# Altium schematic sheet SmartIMU_Dev_Sch.SchDoc: SmartIMU Dev
size 304 x 203 mm; Author: Hom; CompanyName: KitSprout; DrawnBy: Hom; Engineer: Hom; Organization: KitSprout; Revision: A; SheetNumber: 1; SheetTotal: 1; Version: 1.0; LibVersion: 2.10; PageSetup: Record=PageOptions|CenterHorizontal=True|CenterVertical=True|PrintScale=0.96|XCorrection=1.00|YCorrection=1.00|PrintKind=0|BorderSize=5000000|LeftOffset=0|BottomOffset=0|Orientation=2|PaperLength=1000|PaperWidth=1000|Scale=100|PaperSource=7|PrintQuality=-3|MediaType=1|DitherType=10|PrintScaleMode=1|PaperKind=A4|PaperIndex=9
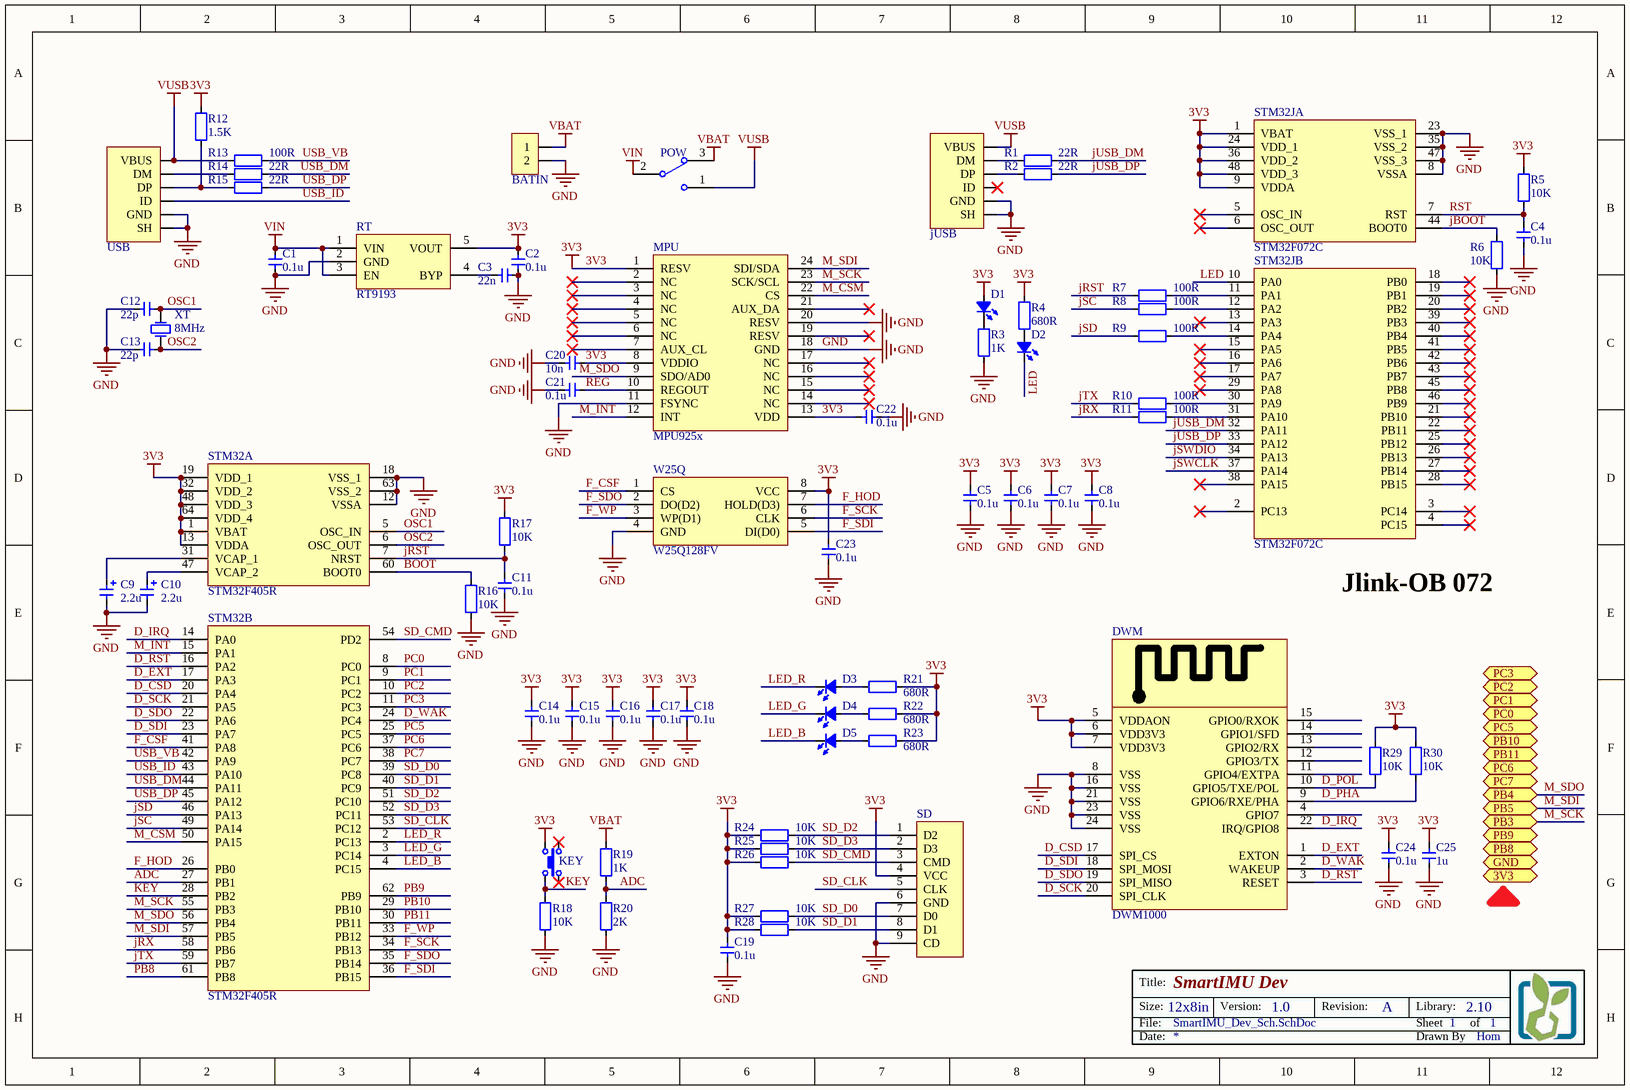
[diagram p0: SmartIMU_Dev_Sch.SchDoc]

## Parts
BATIN  MX1.25_2P  [MX1.25_S90_2P]  (value not drawn)
C1  value 0.1u  [CAP_0603]  (hidden comment: Cap_0603)
C2  value 0.1u  [CAP_0603]  (hidden comment: Cap_0603)
C3  value 22n  [CAP_0603]  (hidden comment: Cap_0603)
C4  value 0.1u  [CAP_0603]  (hidden comment: Cap_0603)
C5  value 0.1u  [CAP_0603]  (hidden comment: Cap_0603)
C6  value 0.1u  [CAP_0603]  (hidden comment: Cap_0603)
C7  value 0.1u  [CAP_0603]  (hidden comment: Cap_0603)
C8  value 0.1u  [CAP_0603]  (hidden comment: Cap_0603)
C9  value 2.2u  [CAP_TAN_P0805]  (hidden comment: Cap_Tan_0805)
C10  value 2.2u  [CAP_TAN_P0805]  (hidden comment: Cap_Tan_0805)
C11  value 0.1u  [CAP_0603]  (hidden comment: Cap_0603)
C12  value 22p  [CAP_0603]  (hidden comment: Cap_0603)
C13  value 22p  [CAP_0603]  (hidden comment: Cap_0603)
C14  value 0.1u  [CAP_0603]  (hidden comment: Cap_0603)
C15  value 0.1u  [CAP_0603]  (hidden comment: Cap_0603)
C16  value 0.1u  [CAP_0603]  (hidden comment: Cap_0603)
C17  value 0.1u  [CAP_0603]  (hidden comment: Cap_0603)
C18  value 0.1u  [CAP_0603]  (hidden comment: Cap_0603)
C19  value 0.1u  [CAP_0603]  (hidden comment: Cap_0603)
C20  value 10n  [CAP_0603]  (hidden comment: Cap_0603)
C21  value 0.1u  [CAP_0603]  (hidden comment: Cap_0603)
C22  value 0.1u  [CAP_0603]  (hidden comment: Cap_0603)
C23  value 0.1u  [CAP_0603]  (hidden comment: Cap_0603)
C24  value 0.1u  [CAP_0603]  (hidden comment: Cap_0603)
C25  value 1u  [CAP_0603]  (hidden comment: Cap_0603)
D1  LED_0603  [LED_0603_YELLOW]  (value not drawn)
D2  LED_0603  [LED_0603_ORANGE]  (value not drawn)
D3  LED_0603  [LED_0603_RED]  (value not drawn)
D4  LED_0603  [LED_0603_GREEN]  (value not drawn)
D5  LED_0603  [LED_0603_BLUE]  (value not drawn)
DWM  DWM1000  [DWM1000]
jUSB  USB_Micro  [USB_Micro-AB]  (value not drawn)
KEY  ButtonTACT  [ButtonTACT_3.5*3.55_90]  (value not drawn)
MPU  MPU925x  [QFN_P0.4_24]
POW  SwitchSPDT_2.8x6.6_90  [SwitchSPDT_2.8X6.6_90]  (value not drawn)
R1  value 22R  [RES_0603]  (hidden comment: Res_0603)
R2  value 22R  [RES_0603]  (hidden comment: Res_0603)
R3  value 1K  [RES_0603]  (hidden comment: Res_0603)
R4  value 680R  [RES_0603]  (hidden comment: Res_0603)
R5  value 10K  [RES_0603]  (hidden comment: Res_0603)
R6  value 10K  [RES_0603]  (hidden comment: Res_0603)
R7  value 100R  [RES_0603]  (hidden comment: Res_0603)
R8  value 100R  [RES_0603]  (hidden comment: Res_0603)
R9  value 100R  [RES_0603]  (hidden comment: Res_0603)
R10  value 100R  [RES_0603]  (hidden comment: Res_0603)
R11  value 100R  [RES_0603]  (hidden comment: Res_0603)
R12  value 1.5K  [RES_0603]  (hidden comment: Res_0603)
R13  value 100R  [RES_0603]  (hidden comment: Res_0603)
R14  value 22R  [RES_0603]  (hidden comment: Res_0603)
R15  value 22R  [RES_0603]  (hidden comment: Res_0603)
R16  value 10K  [RES_0603]  (hidden comment: Res_0603)
R17  value 10K  [RES_0603]  (hidden comment: Res_0603)
R18  value 10K  [RES_0603]  (hidden comment: Res_0603)
R19  value 1K  [RES_0603]  (hidden comment: Res_0603)
R20  value 2K  [RES_0603]  (hidden comment: Res_0603)
R21  value 680R  [RES_0603]  (hidden comment: Res_0603)
R22  value 680R  [RES_0603]  (hidden comment: Res_0603)
R23  value 680R  [RES_0603]  (hidden comment: Res_0603)
R24  value 10K  [RES_0603]  (hidden comment: Res_0603)
R25  value 10K  [RES_0603]  (hidden comment: Res_0603)
R26  value 10K  [RES_0603]  (hidden comment: Res_0603)
R27  value 10K  [RES_0603]  (hidden comment: Res_0603)
R28  value 10K  [RES_0603]  (hidden comment: Res_0603)
R29  value 10K  [RES_0603]  (hidden comment: Res_0603)
R30  value 10K  [RES_0603]  (hidden comment: Res_0603)
RT  RT9193  [SOT23-5]
SD  SD_Card_TF  [SD_Card_TF]  (value not drawn)
STM32  STM32F405R  [LQFP_P0.5_64]  (parts A,B of 2)
STM32J  STM32F072C  [LQFP_P0.5_48]  (parts A,B of 2)
USB  USB_Micro  [USB_Micro-AB]  (value not drawn)
W25Q  W25Q128FV  [SON_P1.27H_8]
XT  value 8MHz  [XT_5032_2]  (hidden comment: XTAL_5032_2P)

## Ports
3V3, GND, PB3, PB4, PB5, PB8, PB9, PB10, PB11, PC0, PC1, PC2, PC3, PC5, PC6, PC7

## Nets
3V3: C2.2 C5.2 C6.2 C7.2 C8.2 C14.1 C15.1 C16.1 C17.1 C18.2 C19.1 C20.2 C22.2 C23.1 C24.1 C25.1 D1.1(A) DWM.5(VDDAON) DWM.6(VDD3V3) DWM.7(VDD3V3) KEY.2 MPU.1(RESV) MPU.8(VDDIO) MPU.13(VDD) R4.2 R5.2 R12.1 R17.2 R21.1 R22.1 R23.1 R24.2 R25.2 R26.2 R27.2 R28.2 R29.2 R30.2 RT.5(VOUT) SD.4(VCC) STM32.1(VBAT) STM32.13(VDDA) STM32.19(VDD_1) STM32.32(VDD_2) STM32.48(VDD_3) STM32.64(VDD_4) STM32J.1(VBAT) STM32J.9(VDDA) STM32J.24(VDD_1) STM32J.36(VDD_2) STM32J.48(VDD_3) W25Q.8(VCC)
GND: BATIN.2 C1.1 C2.1 C3.1 C4.1 C5.1 C6.1 C7.1 C8.1 C9.2 C10.2 C11.1 C12.2 C13.2 C14.2 C15.2 C16.2 C17.2 C18.1 C19.2 C20.1 C21.1 C22.1 C23.2 C24.2 C25.2 DWM.8(VSS) DWM.16(VSS) DWM.21(VSS) DWM.23(VSS) DWM.24(VSS) jUSB.0(SH) jUSB.5(GND) MPU.11(FSYNC) MPU.18(GND) MPU.20(RESV) R3.1 R6.1 R16.1 R18.1 R20.2 RT.2(GND) SD.6(GND) SD.9(CD) STM32.12(VSSA) STM32.18(VSS_1) STM32.63(VSS_2) STM32J.8(VSSA) STM32J.23(VSS_1) STM32J.35(VSS_2) STM32J.47(VSS_3) USB.0(SH) USB.5(GND) W25Q.4(GND)
VBAT: BATIN.1 POW.3 R19.1
VIN: C1.2 POW.2 RT.1(VIN) RT.3(EN)
VUSB: jUSB.1(VBUS) POW.1 R13.2 USB.1(VBUS)
ADC: R19.2 R20.1 STM32.27(PB1)
BOOT: R16.2 STM32.60(BOOT0)
D_CSD: DWM.17(SPI_CS) STM32.20(PA4)
D_EXT: DWM.1(EXTON) STM32.17(PA3)
D_IRQ: DWM.22(IRQ/GPIO8) STM32.14(PA0)
D_PHA: DWM.9(GPIO6/RXE/PHA) R30.1
D_POL: DWM.10(GPIO5/TXE/POL) R29.1
D_RST: DWM.3(RESET) STM32.16(PA2)
D_SCK: DWM.20(SPI_CLK) STM32.21(PA5)
D_SDI: DWM.18(SPI_MOSI) STM32.23(PA7)
D_SDO: DWM.19(SPI_MISO) STM32.22(PA6)
D_WAK: DWM.2(WAKEUP) STM32.24(PC4)
F_CSF: STM32.41(PA8) W25Q.1(CS)
F_HOD: STM32.26(PB0) W25Q.7(HOLD(D3))
F_SCK: STM32.34(PB13) W25Q.6(CLK)
F_SDI: STM32.36(PB15) W25Q.5(DI(D0))
F_SDO: STM32.35(PB14) W25Q.2(DO(D2))
F_WP: STM32.33(PB12) W25Q.3(WP(D1))
jBOOT: R6.2 STM32J.44(BOOT0)
jRST: C11.2 R7.1 R17.1 STM32.7(NRST)
jRX: R11.1 STM32.58(PB6)
jSC: R8.1 STM32.49(PA14)
jSD: R9.1 STM32.46(PA13)
jSWCLK: STM32J.37(PA14)
jSWDIO: STM32J.34(PA13)
jTX: R10.1 STM32.59(PB7)
jUSB_DM: R1.2 STM32J.32(PA11)
jUSB_DP: R2.2 STM32J.33(PA12)
KEY: KEY.1 R18.2 STM32.28(PB2)
LED: D2.2(K) STM32J.10(PA0)
LED_B: D5.2(K) STM32.4(PC15)
LED_G: D4.2(K) STM32.3(PC14)
LED_R: D3.2(K) STM32.2(PC13)
M_CSM: MPU.22(CS) STM32.50(PA15)
M_INT: MPU.12(INT) STM32.15(PA1)
M_SCK: MPU.23(SCK/SCL) STM32.55(PB3) ; port PB3
M_SDI: MPU.24(SDI/SDA) STM32.57(PB5) ; port PB5
M_SDO: MPU.9(SDO/AD0) STM32.56(PB4) ; port PB4
OSC1: C12.1 STM32.5(OSC_IN) XT.2(OSC2)
OSC2: C13.1 STM32.6(OSC_OUT) XT.1(OSC1)
PB8: STM32.61(PB8)
PB9: STM32.62(PB9)
PB10: STM32.29(PB10)
PB11: STM32.30(PB11)
PC0: STM32.8(PC0)
PC1: STM32.9(PC1)
PC2: STM32.10(PC2)
PC3: STM32.11(PC3)
PC5: STM32.25(PC5)
PC6: STM32.37(PC6)
PC7: STM32.38(PC7)
REG: C21.2 MPU.10(REGOUT)
RST: C4.2 R5.1 STM32J.7(RST)
SD_CLK: SD.5(CLK) STM32.53(PC12)
SD_CMD: R26.1 SD.3(CMD) STM32.54(PD2)
SD_D0: R27.1 SD.7(D0) STM32.39(PC8)
SD_D1: R28.1 SD.8(D1) STM32.40(PC9)
SD_D2: R24.1 SD.1(D2) STM32.51(PC10)
SD_D3: R25.1 SD.2(D3) STM32.52(PC11)
USB_DM: R14.1 STM32.44(PA11)
USB_DP: R15.1 STM32.45(PA12)
USB_ID: STM32.43(PA10) USB.4(ID)
USB_VB: R13.1 STM32.42(PA9)
NetC3_2: C3.2 RT.4(BYP)
NetC9_1: C9.1 STM32.31(VCAP_1)
NetC10_1: C10.1 STM32.47(VCAP_2)
NetD1_2: D1.2(K) R3.2
NetD2_1: D2.1(A) R4.1
NetD3_1: D3.1(A) R21.2
NetD4_1: D4.1(A) R22.2
NetD5_1: D5.1(A) R23.2
NetjUSB_2: jUSB.2(DM) R1.1
NetjUSB_3: jUSB.3(DP) R2.1
NetR7_2: R7.2 STM32J.11(PA1)
NetR8_2: R8.2 STM32J.12(PA2)
NetR9_2: R9.2 STM32J.14(PA4)
NetR10_2: R10.2 STM32J.30(PA9)
NetR11_2: R11.2 STM32J.31(PA10)
NetR12_2: R12.2 R15.2 USB.3(DP)
NetR14_2: R14.2 USB.2(DM)

Not connected (* = marked no-connect by the designer): DWM 4(GPIO7) 11(GPIO4/EXTPA) 12(GPIO3/TX) 13(GPIO2/RX) 14(GPIO1/SFD) 15(GPIO0/RXOK); jUSB 4(ID)*; KEY 3* 4*; MPU 2(NC)* 3(NC)* 4(NC)* 5(NC)* 6(NC)* 7(AUX_CL)* 14(NC)* 15(NC)* 16(NC)* 17(NC)* 19(RESV)* 21(AUX_DA)*; STM32J 2(PC13)* 3(PC14)* 4(PC15)* 5(OSC_IN)* 6(OSC_OUT)* 13(PA3)* 15(PA5)* 16(PA6)* 17(PA7)* 18(PB0)* 19(PB1)* 20(PB2)* 21(PB10)* 22(PB11)* 25(PB12)* 26(PB13)* 27(PB14)* 28(PB15)* 29(PA8)* 38(PA15)* 39(PB3)* 40(PB4)* 41(PB5)* 42(PB6)* 43(PB7)* 45(PB8)* 46(PB9)*

## Notes on the sheet
- (near STM32J) Jlink-OB 072
- Title:
- Size:
- Date:
- File:
- 12x8in
- Version:
- Revision:
- Sheet
- Drawn By
- Library:
- of

## Library data of the parts
BATIN = MX1.25_2P: MX
C1-C8 C11-C25 = Cap_0603: Capacitor
C9 C10 = Cap_Tan_0805: Capacitor
D1-D5 = LED_0603: LED
DWM = DWM1000: Module; Manufacturer: Decawave Limited; Frequency: 3.5GHz ~ 6.5GHz; Data Rate: 6.8Mbps; Serial Interfaces: SPI; Antenna Type: Integrated, Chip; Voltage - Supply: 2.8 V ~ 3.6 V; Current - Receiving: 64mA; Current - Transmitting: 31mA; Supplier 1: Digi-Key; Manufacturer Part Number: DWM1000; RoHS: RoHS Compliant; Category: RF/IF and RFID; Stock 1: 1028; Pricing 1: 1=32.16, 10=26.704, 100=24.24, 250=22.51296 (USD); Packaging: Cut Tape (CT); RF Family/Standard: 802.15.4; Protocol: -; Modulation: -; Power - Output: -; Sensitivity: -; Memory Size: -; Mounting Type: Surface Mount; Operating Temperature: -40°C ~ 85°C; Package / Case: Module; ComponentLink1URL: http://www.decawave.com/sites/default/files/product-pdf/dwm1000-product-brief.pdf; ComponentLink1Description: http://www.decawave.com/sites/default/files/product-pdf/dwm1000-product-brief.pdf; Supplier Part Number 1: 1479-1002-1-ND
jUSB USB = USB_Micro: USB
KEY = ButtonTACT: Button
MPU = MPU925x: Sensor Motion
POW = SwitchSPDT_2.8x6.6_90: Switch
R1-R30 = Res_0603: Resistor
RT = RT9193: Power
SD = SD_Card_TF: SD
STM32 = STM32F405R: MCU
STM32J = STM32F103C: MCU
W25Q = W25Q_8: FLASH
XT = XTAL_5032_2P: Crystal Oscillator